# EAGLE design homenodeInline (EAGLE 7.5.0)
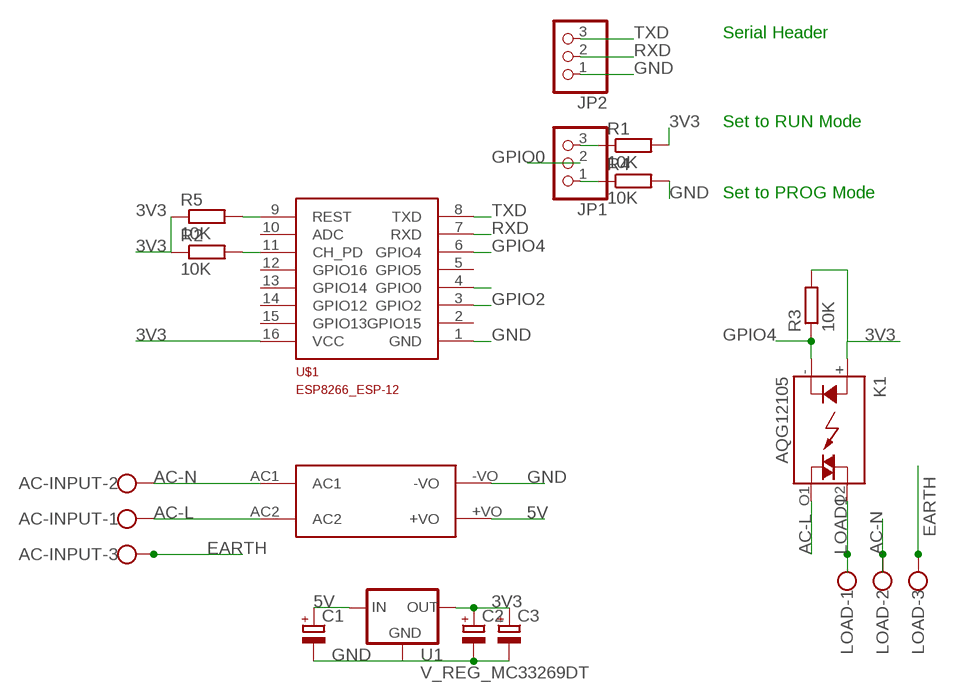
[diagram p0: schematic, sheet 1]

## Parts
AC-INPUT  W237-103  [W237-103]
C1  CPOL-EUC  [PANASONIC_C]
C2  CPOL-EUC  [PANASONIC_C]
C3  CPOL-EUC  [PANASONIC_C]
JP1  PINHD-1X3  [1X03]
JP2  PINHD-1X3  [1X03]
K1  AQG12105  [AQG]
LOAD  W237-103  [W237-103]
R1  10K  R-EU_M1206  [M1206]
R2  10K  R-EU_M1206  [M1206]
R3  10K  R-EU_M1206  [M1206]
R4  10K  R-EU_M1206  [M1206]
R5  10K  R-EU_M1206  [M1206]
U1  V_REG_MC33269DT  [DPAK]
U$1  ESP8266_ESP-12  [ESP8266-ESP12]
U$4  HLK-PM01  [HLK-PM01]

## Nets
3V3: C2.+ C3.+ K1.+(A) R1.2 R2.1 R3.2 R5.1 U1.4(OUT) U$1.16(VCC)
5V: C1.+ U1.3(IN) U$4.+VO
AC-L: AC-INPUT.1 K1.O1(DS2) U$4.AC2
AC-N: AC-INPUT.2 LOAD.2 U$4.AC1
CH_PD: R2.2 U$1.11(CH_PD)
EARTH: AC-INPUT.3 LOAD.3
GND: C1.- C2.- C3.- JP2.1 R4.2 U1.1(GND) U$1.1(GND) U$4.-VO
GPIO0: JP1.2 U$1.4(GPIO0)
GPIO2: U$1.3(GPIO2)
GPIO4: K1.-(K) R3.1 U$1.6(GPIO4)
LOAD1: K1.O2(DS1) LOAD.1
N$1: JP1.3 R1.1
N$3: JP1.1 R4.1
N$4: R5.2 U$1.9(REST)
RXD: JP2.2 U$1.7(RXD)
TXD: JP2.3 U$1.8(TXD)
Unconnected: U$1.2(GPIO15) U$1.5(GPIO5) U$1.10(ADC) U$1.12(GPIO16) U$1.13(GPIO14) U$1.14(GPIO12) U$1.15(GPIO13)

## Notes on the sheet
- Serial Header
- Set to RUN Mode
- Set to PROG Mode

## Library data of the parts
AC-INPUT LOAD = con-wago-500:W237-103: WAGO SCREW CLAMP; MPN: 237-103; OC_FARNELL: unknown; OC_NEWARK: 18M7116
C1-C3 = resistor:CPOL-EU: POLARIZED CAPACITOR, European symbol
JP1 JP2 = pinhead:PINHD-1X3: PIN HEADER
K1 = relay:AQG*: SOLID STATE RELAY NAiS Zero-cross, Non zero-cross Source: http://www.mew-europe.com/.. en_ds_61611_0000.pdf; MF: AROMAT/ MATSUSHITA; MPN: AQG12105; OC_FARNELL: unknown; OC_NEWARK: 20J4759
R1-R5 = resistor:R-EU_: RESISTOR, European symbol
U1 = SparkFun-PowerIC:V_REG_MC33269
U$1 = ESP8266-ESP12:ESP8266_ESP-12: ESP8266 ESP-12 Discussion about pins here: http://www.esp8266.com/viewtopic.php?f=13&t=1429
U$4 = hlk-pm01:HLK-PM01

## Board
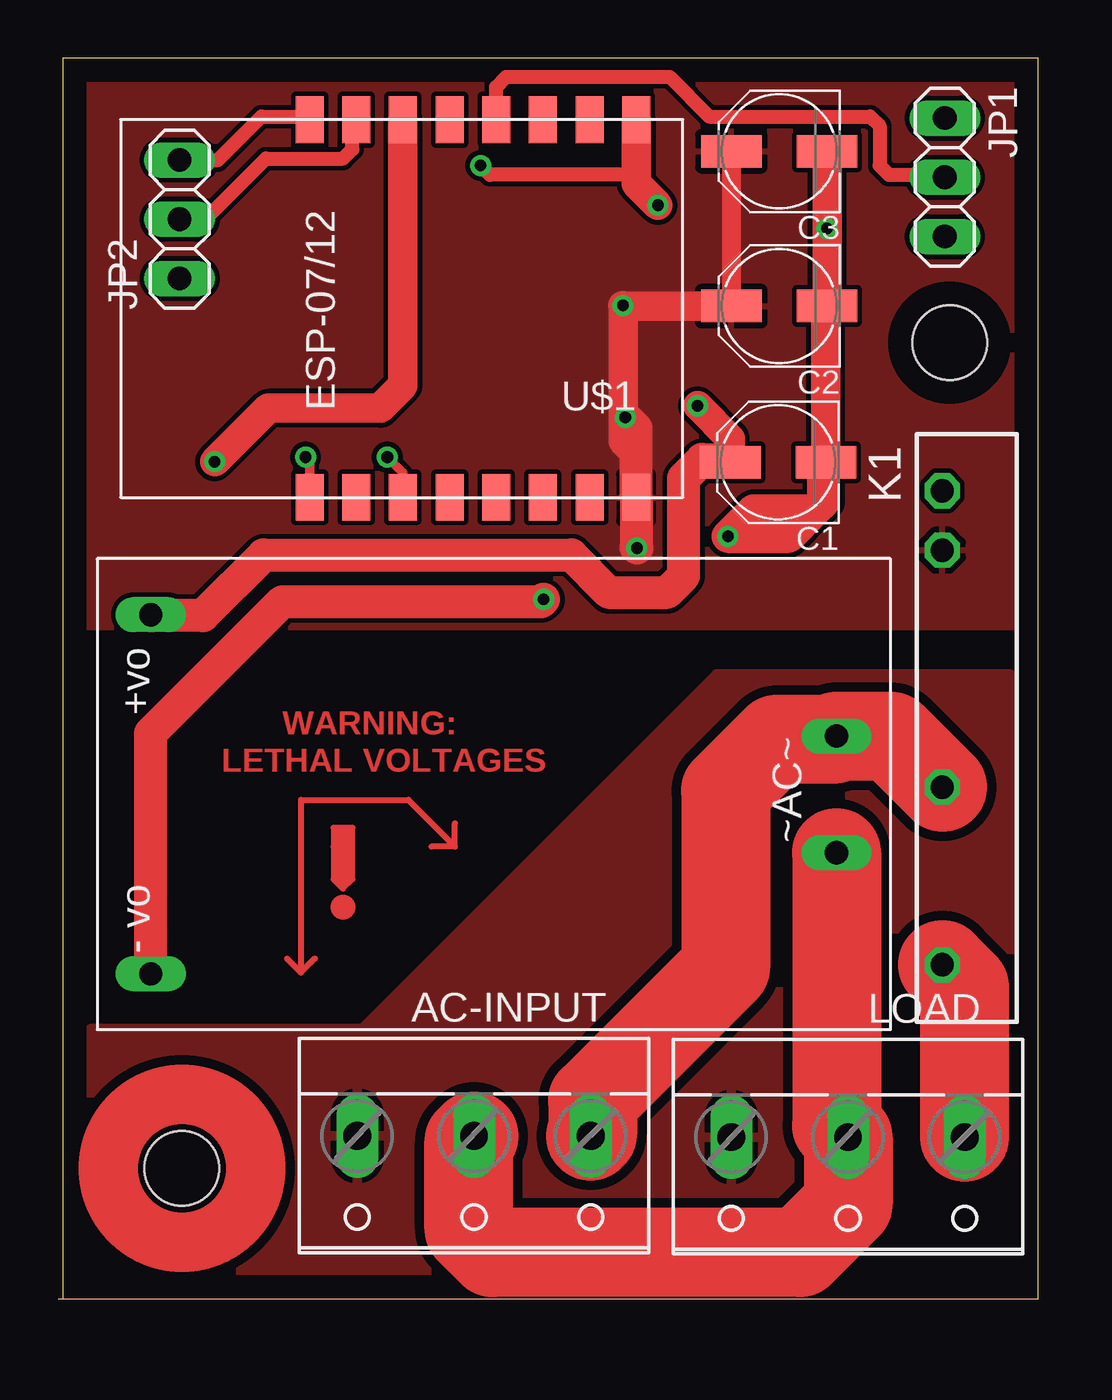
[diagram p1: board, top side]
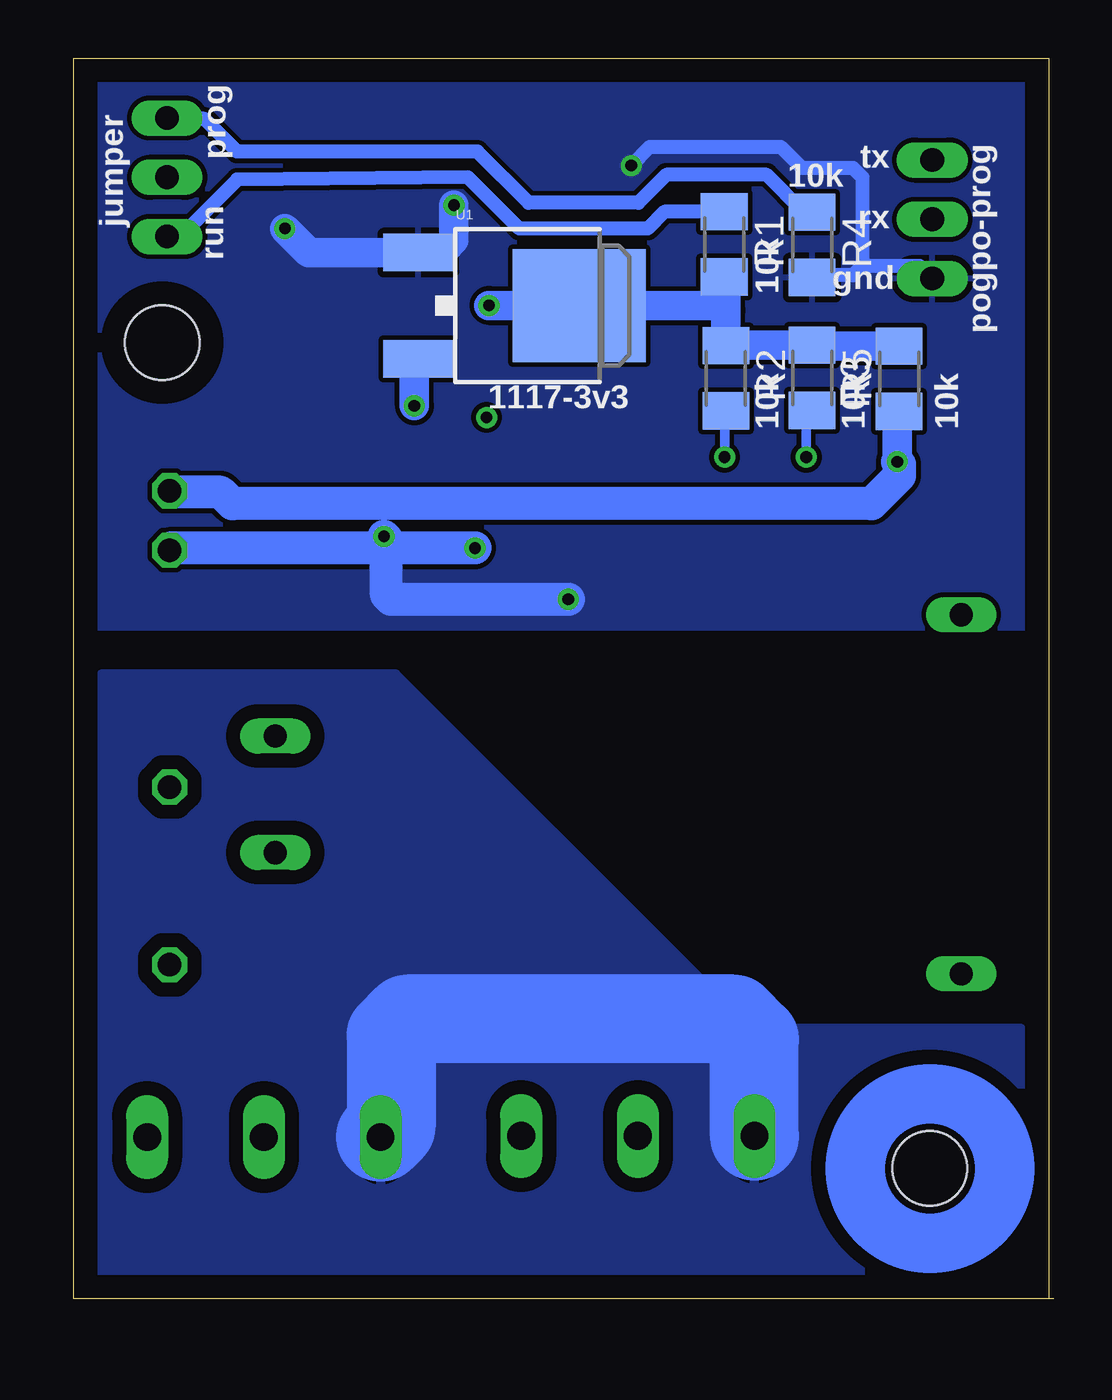
[diagram p2: board, bottom side, seen from below]

Size 42 x 53.2 mm. Coordinates in mm from the lower left corner, seen from the top.
Outline: 0,0 0.2,0
Outline: 0.2,0 42,0 42,53.2 0.2,53.2 0.2,0
Copper layers (1*16): Top 0.035mm / dielectric 1.5mm / Bottom 0.035mm
Design rules "default": minimum track width 10mil, minimum drill 24mil, track to track 8mil, track to pad 8mil, pad to pad 8mil, via to via 8mil, smd to smd 8mil, copper to edge 40mil, drill to drill 8mil, minimum pad ring 10mil, minimum via ring 8mil, stop-mask expansion 4mil, vias tented up to drill 0mil, thermal gap 10mil
Holes 3.2 mm at 5.3,5.6 38.2,41

### Footprints (pad centres in the part's own frame; a part is rotated, then mirrored left to right if it is on the bottom)
W237-103 = drill 1.194 long: 1 -5,-1.29; 2 0,-1.29; 3 5,-1.29
PANASONIC_C = smd 2.6 x 1.4: + 2.05,0; - -2.05,0
1X03 = drill 1.016 long: 1 -2.54,0; 2 0,0; 3 2.54,0
AQG = drill 1 octagon: + -7.62,0; - -10.16,0; O1 2.54,0; O2 10.16,0
M1206 = smd 1.6 x 2: 1 -1.4,0; 2 1.4,0
DPAK = smd 1.6 x 3: 1 -2.28,-5.31; 3 2.28,-5.31 | smd 4.826 x 5.715: 4 0,1.588
ESP8266-ESP12 = smd 2 x 1.2: 1 16.2,2; 2 16.2,4; 3 16.2,6; 4 16.2,8; 5 16.2,10; 6 16.2,12; 7 16.2,14; 8 16.2,16; 9 0,16; 10 0,14; 11 0,12; 12 0,10; 13 0,8; 14 0,6; 15 0,4; 16 0,2
HLK-PM01 = drill 1 long: +VO 31.7,2.4; -VO 31.7,17.8; AC1 2.3,12.6; AC2 2.3,7.6

### Placement (x,y rotation side)
AC-INPUT  17.82,5.7 180 top
C1  30.85,35.88 180 top
C2  30.9,42.58 180 top
C3  30.9,49.21 180 top
JP1  38,48.1 270 top
JP2  5.2,46.3 90 top
K1  37.89,24.49 270 top
LOAD  33.85,5.65 180 top
R1  14.11,45.22 270 bottom
R2  14.04,39.48 270 bottom
R3  6.62,39.46 90 bottom
R4  10.35,45.2 270 bottom
R5  10.35,39.5 270 bottom
U1  21.92,42.59 270 bottom
U$1  26.77,34.37 90 top
U$4  35.66,31.74 180 top

### Tracks (layer width: path | path; a pad name or v marks a point on that pad's centre or on a via)
3V3  (via drill 0.5 pad 0.25)
  Top 0.813: C3.+ C2.+
  Top 1.27: C2.+ 24.22,42.58 | 24.22,42.58 v24.2,42.6 | 24.22,42.58 24.22,36.78 24.7,36.3 24.7,34.44 U$1.16
  Top 1.422: v24.3,37.8 24.77,37.33 U$1.16 24.77,32.23 v24.8,32.2
  Bottom 0.61: R5.1 9.8,40.9 9.7,41
  Bottom 1.27: R5.1 10.9,40.9 | 10.9,40.9 14.02,40.9 R2.1 14.04,42.4 | 14.04,42.4 14.04,43.76 R1.2 | 14.04,42.4 14.24,42.59 U1.4 v24.2,42.6 | R3.2 10.86,40.86 10.9,40.9
  Bottom 1.422: v24.8,32.2 37.8,32.2 K1.+
  pour Top: 0.4,53 41.8,53 41.8,28.8 0.4,28.8
5V  (via drill 0.5 pad 0.25)
  Top 1.27: C1.+ 28.8,36.9 v27.4,38.3
  Top 1.422: U$4.+VO 4,29.3 6.2,29.3 8.8,31.9 22,31.9 23.6,30.3 26.1,30.3 26.8,31 26.8,35.2 27.6,36 28.68,36 C1.+
  Bottom 1.27: v27.4,38.3 27.4,40.14 U1.3
AC-L
  Top 3.81: K1.O1 35.7,24.14 U$4.AC2 33.22,24 30.8,24 28.6,21.8 28.6,14.2 22.9,8.5 22.9,7.07 AC-INPUT.1
AC-N
  Top 3.81: U$4.AC1 33.36,7.43 LOAD.2 33.85,4.05 31.8,2 18.6,2 17.6,3 17.6,6.77 AC-INPUT.2
CH_PD  (via drill 0.5 pad 0.25)
  Top 0.406: U$1.11 14.77,35.43 v14.1,36.1
  Bottom 0.406: v14.1,36.1 14.1,38.02 R2.2
EARTH
  Bottom 3.81: AC-INPUT.3 12.82,11.12 13.7,12 27.7,12 28.4,11.3 28.4,7.39 LOAD.3
  pour Bottom (isolate 0.61): 41.6,0.4 0.6,0.4 0.6,10.8 1.4,11.6 13,11.6 28.2,26.8 40.8,26.8 41.6,26
  pour Top (isolate 0.406): 41.6,0.4 0.6,0.4 0.6,10.8 1.4,11.6 13,11.6 28.2,26.8 40.8,26.8 41.6,26
GND  (via drill 0.5 pad 0.25)
  Top 0.61: 24.77,48.87 U$1.1 24.77,48.57 24.4,48.2 18.5,48.2 v18.1,48.6
  Top 1.27: C3.- v32.95,45.9 C2.- 32.9,42.53 C1.- | U$1.1 24.77,47.83 v25.7,46.9
  Top 1.422: U$4.-VO 3.96,24.26 9.6,29.9 20.7,29.9 v20.8,30 | 32.4,33.8 29.8,33.8 v28.7,32.7 31.3,32.7 32.4,33.8 | 32.4,33.8 32.8,34.2 32.8,35.78 C1.-
  Bottom 0.61: 8.2,44.3 8.2,48.1 8.6,48.5 10.8,48.5 11.7,49.4 17.3,49.4 v18.1,48.6 | 8.2,44.3 8.6,43.9 10.25,43.9 R4.2 | 8.2,44.3 5.74,44.3 JP2.1
  Bottom 1.27: v32.95,45.9 31.92,44.87 U1.1 27.1,45 26.1,45 25.7,45.4 v25.7,46.9
  Bottom 1.422: v20.8,30 28.4,30 28.6,30.2 28.6,32.6 v28.7,32.7
  pour Bottom: 0.6,53 41.8,53 41.8,28.8 0.4,28.8 0.4,53
GPIO0
  Top 0.61: U$1.4 18.77,51.97 19.2,52.4 26.2,52.4 27.9,50.7 34.8,50.7 35.2,50.3 35.2,48.6 35.6,48.2 37.9,48.2 JP1.2
GPIO4  (via drill 0.5 pad 0.25)
  Top 1.27: U$1.6 14.77,39.17 13.8,38.2 9,38.2 v6.7,35.9
  Bottom 1.27: v6.7,35.9 6.7,37.98 R3.1
  Bottom 1.422: v6.7,35.9 6.6,35.8 6.6,35.3 7.8,34.1 35.2,34.1 35.7,34.6 37.84,34.6 K1.-
LOAD1
  Top 3.81: LOAD.1 38.85,13.37 K1.O2
N$1
  Bottom 0.61: R1.1 16.68,46.62 17.4,45.9 22.9,45.9 25.1,48.1 35,48 37.4,45.6 37.86,45.6 JP1.3
N$2
  Top 0.254: 10.4,14 10.4,21.4 15,21.4 17,19.4 | 17,19.4 17,20.4 | 17,19.4 16,19.4 | 10.4,14 11,14.6 | 10.4,14 9.8,14.6
N$3
  Bottom 0.61: R4.1 10.7,46.6 12.3,48.2 16.6,48.2 17.8,47 22.5,47 24.7,49.2 35,49.2 36.4,50.6 36.56,50.6 JP1.1
N$4  (via drill 0.5 pad 0.25)
  Top 0.406: U$1.9 10.77,35.93 v10.6,36.1
  Bottom 0.406: v10.6,36.1 10.6,37.85 R5.2
N$5
  Top 0.254: 11.8,20.2 11.8,19.4 | 11.8,19.4 11.8,18 12.2,17.6 12.6,18 12.6,20.2 11.8,20.2 | 11.8,20.2 12,20 12.4,20 12.4,19.8 12,19.8 12,19.6 12.4,19.6 12.4,19.2 12,19.2 | 12,19.2 11.8,19.4 | 11.8,19.4 12.2,19.4 12.2,18.8 12,18.6 | 12,18.6 12,19.2 | 12,18.6 12,18.4 | 12,18.2 12,18 12.2,17.8 12.4,18 12.4,18.8 | 12.4,19 12.4,18.8 | 12.4,18.8 12,18.4 | 12,18.4 12,18.2 | 12,18.2 12.2,18 12.2,18.4
N$6
  Top 0.254: 12.2,16.8 12.2,17
RXD
  Top 0.61: JP2.2 6.3,46.3 8.9,48.9 12.2,48.9 12.6,49.3 12.6,50.4 U$1.7
TXD
  Top 0.61: JP2.3 6.84,48.84 8.7,50.7 10.64,50.7 U$1.8
(copper drawn outside any net)
  shapes: Bottom circle x1, Top circle x4

### Text on the board
Top: WARNING: | LETHAL VOLTAGES
bPlace: prog | jumper | 10k | tx | run | rx | 10k | gnd | pogpo-prog | 10k | 10k | 10k | 1117-3v3
OHSILK: 100u | 100u | 100u | + | - | HLK-PM01 / AC->5V MODULE | OMROM G3MB-202P | POWER IN | LOAD OUT | 2A MAX | EARTH | AC-N | AC-L\ | EARTH | AC-N | AC-L\